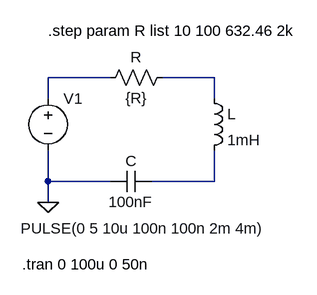
[diagram p0: schematic 05_RLC_serie.asc]
05_RLC_serie.asc, the LTspice schematic file:
Version 4
SHEET 1 880 680
WIRE 160 112 64 112
WIRE 320 112 240 112
WIRE 64 144 64 112
WIRE 320 144 320 112
WIRE 64 272 64 224
WIRE 160 272 64 272
WIRE 320 272 320 224
WIRE 320 272 224 272
WIRE 64 304 64 272
FLAG 64 304 0
SYMBOL ind 304 128 R0
SYMATTR InstName L
SYMATTR Value 1mH
SYMBOL res 256 96 R90
WINDOW 0 0 56 VBottom 2
WINDOW 3 32 56 VTop 2
SYMATTR InstName R
SYMATTR Value {R}
SYMBOL voltage 64 128 R0
WINDOW 3 -42 216 Left 2
WINDOW 123 0 0 Left 0
WINDOW 39 0 0 Left 0
SYMATTR InstName V1
SYMATTR Value PULSE(0 5 10u 100n 100n 2m 4m)
SYMBOL cap 224 256 R90
WINDOW 0 0 32 VBottom 2
WINDOW 3 32 32 VTop 2
SYMATTR InstName C
SYMATTR Value 100nF
TEXT 24 400 Left 2 !.tran 0 100u 0 50n
TEXT 64 40 Left 2 !.step param R list 10 100 632.46 2k

The netlist it stands for:
* 05_RLC_serie.asc
L N002 N003 1mH
R N002 N001 {R}
V1 N001 0 PULSE(0 5 10u 100n 100n 2m 4m)
C N003 0 100nF
.tran 0 100u 0 50n
.step param R list 10 100 632.46 2k
.backanno
.end